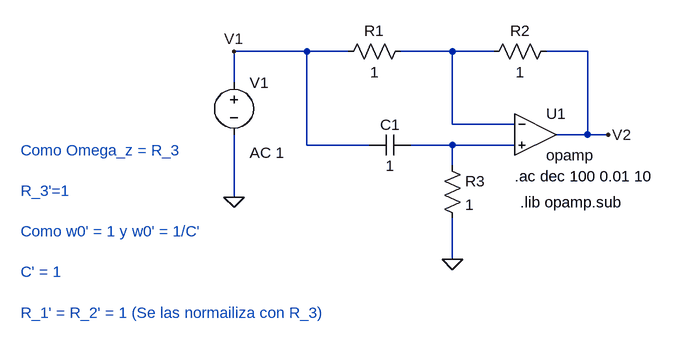
[diagram p0: schematic Draft5.asc]
Draft5.asc, the LTspice schematic file:
Version 4.1
SHEET 1 936 680
WIRE 0 144 -112 144
WIRE 64 144 0 144
WIRE 224 144 144 144
WIRE 288 144 224 144
WIRE 432 144 368 144
WIRE -112 192 -112 144
WIRE 224 256 224 144
WIRE 320 256 224 256
WIRE 432 272 432 144
WIRE 432 272 384 272
WIRE 464 272 432 272
WIRE 0 288 0 144
WIRE 96 288 0 288
WIRE 224 288 160 288
WIRE 320 288 224 288
WIRE 224 320 224 288
WIRE -112 368 -112 272
WIRE 224 464 224 400
FLAG 224 464 0
FLAG -112 144 V1
FLAG -112 368 0
FLAG 464 272 V2
SYMBOL res 160 128 R90
WINDOW 0 0 56 VBottom 2
WINDOW 3 32 56 VTop 2
SYMATTR InstName R1
SYMATTR Value 1
SYMBOL res 384 128 R90
WINDOW 0 0 56 VBottom 2
WINDOW 3 32 56 VTop 2
SYMATTR InstName R2
SYMATTR Value 1
SYMBOL res 208 304 R0
SYMATTR InstName R3
SYMATTR Value 1
SYMBOL cap 160 272 R90
WINDOW 0 0 32 VBottom 2
WINDOW 3 32 32 VTop 2
SYMATTR InstName C1
SYMATTR Value 1
SYMBOL OpAmps\\opamp 352 208 R0
SYMATTR InstName U1
SYMBOL voltage -112 176 R0
WINDOW 123 24 124 Left 2
WINDOW 39 0 0 Left 0
SYMATTR InstName V1
SYMATTR Value ""
SYMATTR Value2 AC 1
TEXT -440 296 Left 2 ;Como Omega_z = R_3\n \nR_3'=1\n \nComo w0' = 1 y w0' = 1/C'\n \nC' = 1\n \nR_1' = R_2' = 1 (Se las normailiza con R_3)
TEXT 320 336 Left 2 !.ac dec 100 0.01 10
TEXT 328 376 Left 2 !.lib opamp.sub

The netlist it stands for:
* Draft5.asc
R1 N001 V1 1
R2 V2 N001 1
R3 N002 0 1
C1 N002 V1 1
X§U1 N001 N002 V2 opamp Aol=100K GBW=10Meg  ; pins invin noninvin out
V1 V1 0 AC 1
* Como Omega_z = R_3
* R_3'=1
* Como w0' = 1 y w0' = 1/C'
* C' = 1
* R_1' = R_2' = 1 (Se las normailiza con R_3)
.ac dec 100 0.01 10
.lib opamp.sub
.backanno
.end